# Altium schematic sheet IKCM30F60GD.SchDoc
size 762 x 381 mm; SheetNumber: 2; SheetTotal: 8
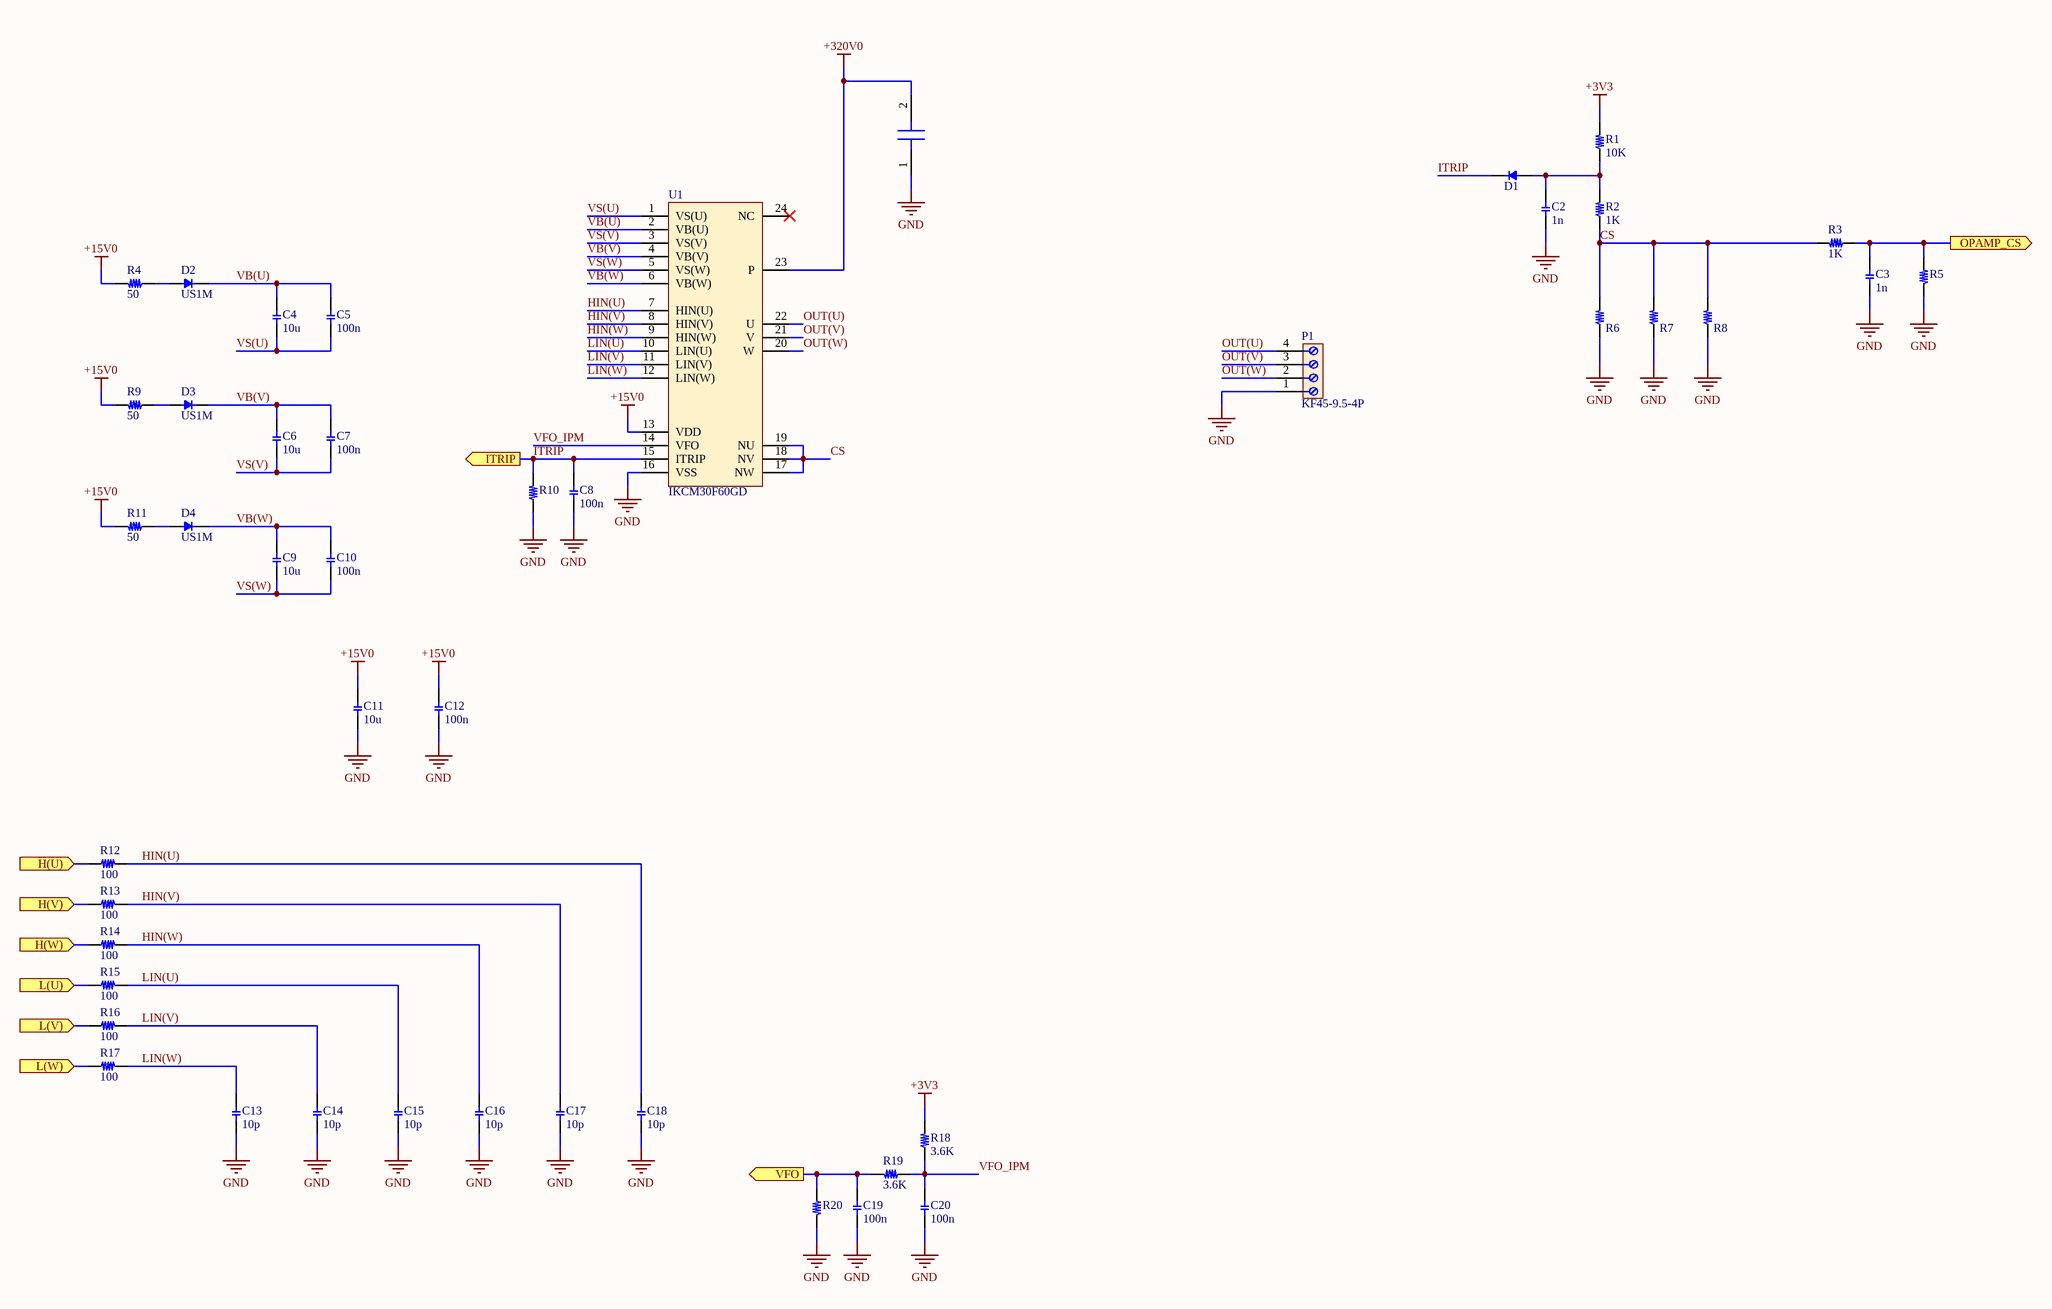
[diagram p0: IKCM30F60GD.SchDoc]

## Parts
C1  CAP  [C FILM 15mm]  (value not drawn)
C2  1n  [C 0603]
C3  1n  [C 0603]
C4  10u  [C 0603]
C5  100n  [C 0603]
C6  10u  [C 0603]
C7  100n  [C 0603]
C8  100n  [C 0603]
C9  10u  [C 0603]
C10  100n  [C 0603]
C11  10u  [C 0603]
C12  100n  [C 0603]
C13  10p  [C 0603]
C14  10p  [C 0603]
C15  10p  [C 0603]
C16  10p  [C 0603]
C17  10p  [C 0603]
C18  10p  [C 0603]
C19  100n  [C 0603]
C20  100n  [C 0603]
D1  DIOD_SMD  [D SOD-323]  (value not drawn)
D2  US1M  [DIOD_SMA]
D3  US1M  [DIOD_SMA]
D4  US1M  [DIOD_SMA]
P1  KF45-9.5-4P  [DG45C-B-04P-13]
R1  10K  [R 0603]
R2  1K  [R 0603]
R3  1K  [R 0603]
R4  50  [R 1206]
R5  1K  [R 0603]  (value not drawn)
R6  RES_SMD  [R 2512]  (value not drawn)
R7  RES_SMD  [R 2512]  (value not drawn)
R8  RES_SMD  [R 2512]  (value not drawn)
R9  50  [R 1206]
R10  1K  [R 0603]  (value not drawn)
R11  50  [R 1206]
R12  100  [R 0603]
R13  100  [R 0603]
R14  100  [R 0603]
R15  100  [R 0603]
R16  100  [R 0603]
R17  100  [R 0603]
R18  3.6K  [R 0603]
R19  3.6K  [R 0603]
R20  3.6K  [R 0603]  (value not drawn)
U1  IKCM30F60GD  [INF-CIPOS MINI]

## Ports
H(U) (in), H(V) (in), H(W) (in), ITRIP (out), L(U) (in), L(V) (in), L(W) (in), OPAMP_CS (out), VFO (out)

## Nets
+3V3: R1.2 R18.2
+15V0: C11.2 C12.2 R4.2 R9.2 R11.2 U1.13(VDD)
+320V0: C1.2 U1.23(P)
GND: C1.1 C2.1 C3.1 C8.1 C11.1 C12.1 C13.1 C14.1 C15.1 C16.1 C17.1 C18.1 C19.1 C20.1 P1.1 R5.2 R6.1 R7.1 R8.1 R10.1 R20.2 U1.16(VSS)
CS: R2.1 R3.2 R6.2 R7.2 R8.2 U1.17(NW) U1.18(NV) U1.19(NU)
H(U): R12.1 ; port H(U)
H(V): R13.1 ; port H(V)
H(W): R14.1 ; port H(W)
HIN(U): C18.2 R12.2 U1.7(HIN(U))
HIN(V): C17.2 R13.2 U1.8(HIN(V))
HIN(W): C16.2 R14.2 U1.9(HIN(W))
ITRIP: C8.2 D1.2 R10.2 U1.15(ITRIP) ; port ITRIP
L(U): R15.1 ; port L(U)
L(V): R16.1 ; port L(V)
L(W): R17.1 ; port L(W)
LIN(U): C15.2 R15.2 U1.10(LIN(U))
LIN(V): C14.2 R16.2 U1.11(LIN(V))
LIN(W): C13.2 R17.2 U1.12(LIN(W))
OPAMP_CS: C3.2 R3.1 R5.1 ; port OPAMP_CS
OUT(U): P1.4 U1.22(U)
OUT(V): P1.3 U1.21(V)
OUT(W): P1.2 U1.20(W)
VB(U): C4.2 C5.2 D2.2 U1.2(VB(U))
VB(V): C6.2 C7.2 D3.2 U1.4(VB(V))
VB(W): C9.2 C10.2 D4.2 U1.6(VB(W))
VFO: C19.2 R19.2 R20.1 ; port VFO
VFO_IPM: C20.2 R18.1 R19.1 U1.14(VFO)
VS(U): C4.1 C5.1 U1.1(VS(U))
VS(V): C6.1 C7.1 U1.3(VS(V))
VS(W): C9.1 C10.1 U1.5(VS(W))
NetC2_2: C2.2 D1.1 R1.1 R2.2
NetD2_1: D2.1 R4.1
NetD3_1: D3.1 R9.1
NetD4_1: D4.1 R11.1

Not connected (* = marked no-connect by the designer): U1 24(NC)*

## Library data of the parts
C2-C20 = CAP_SMD
D2-D4 = DIOD_SMD
R1-R5 R9-R20 = RES_SMD